# EAGLE design riffle328-REVA (EAGLE 6.5.0)
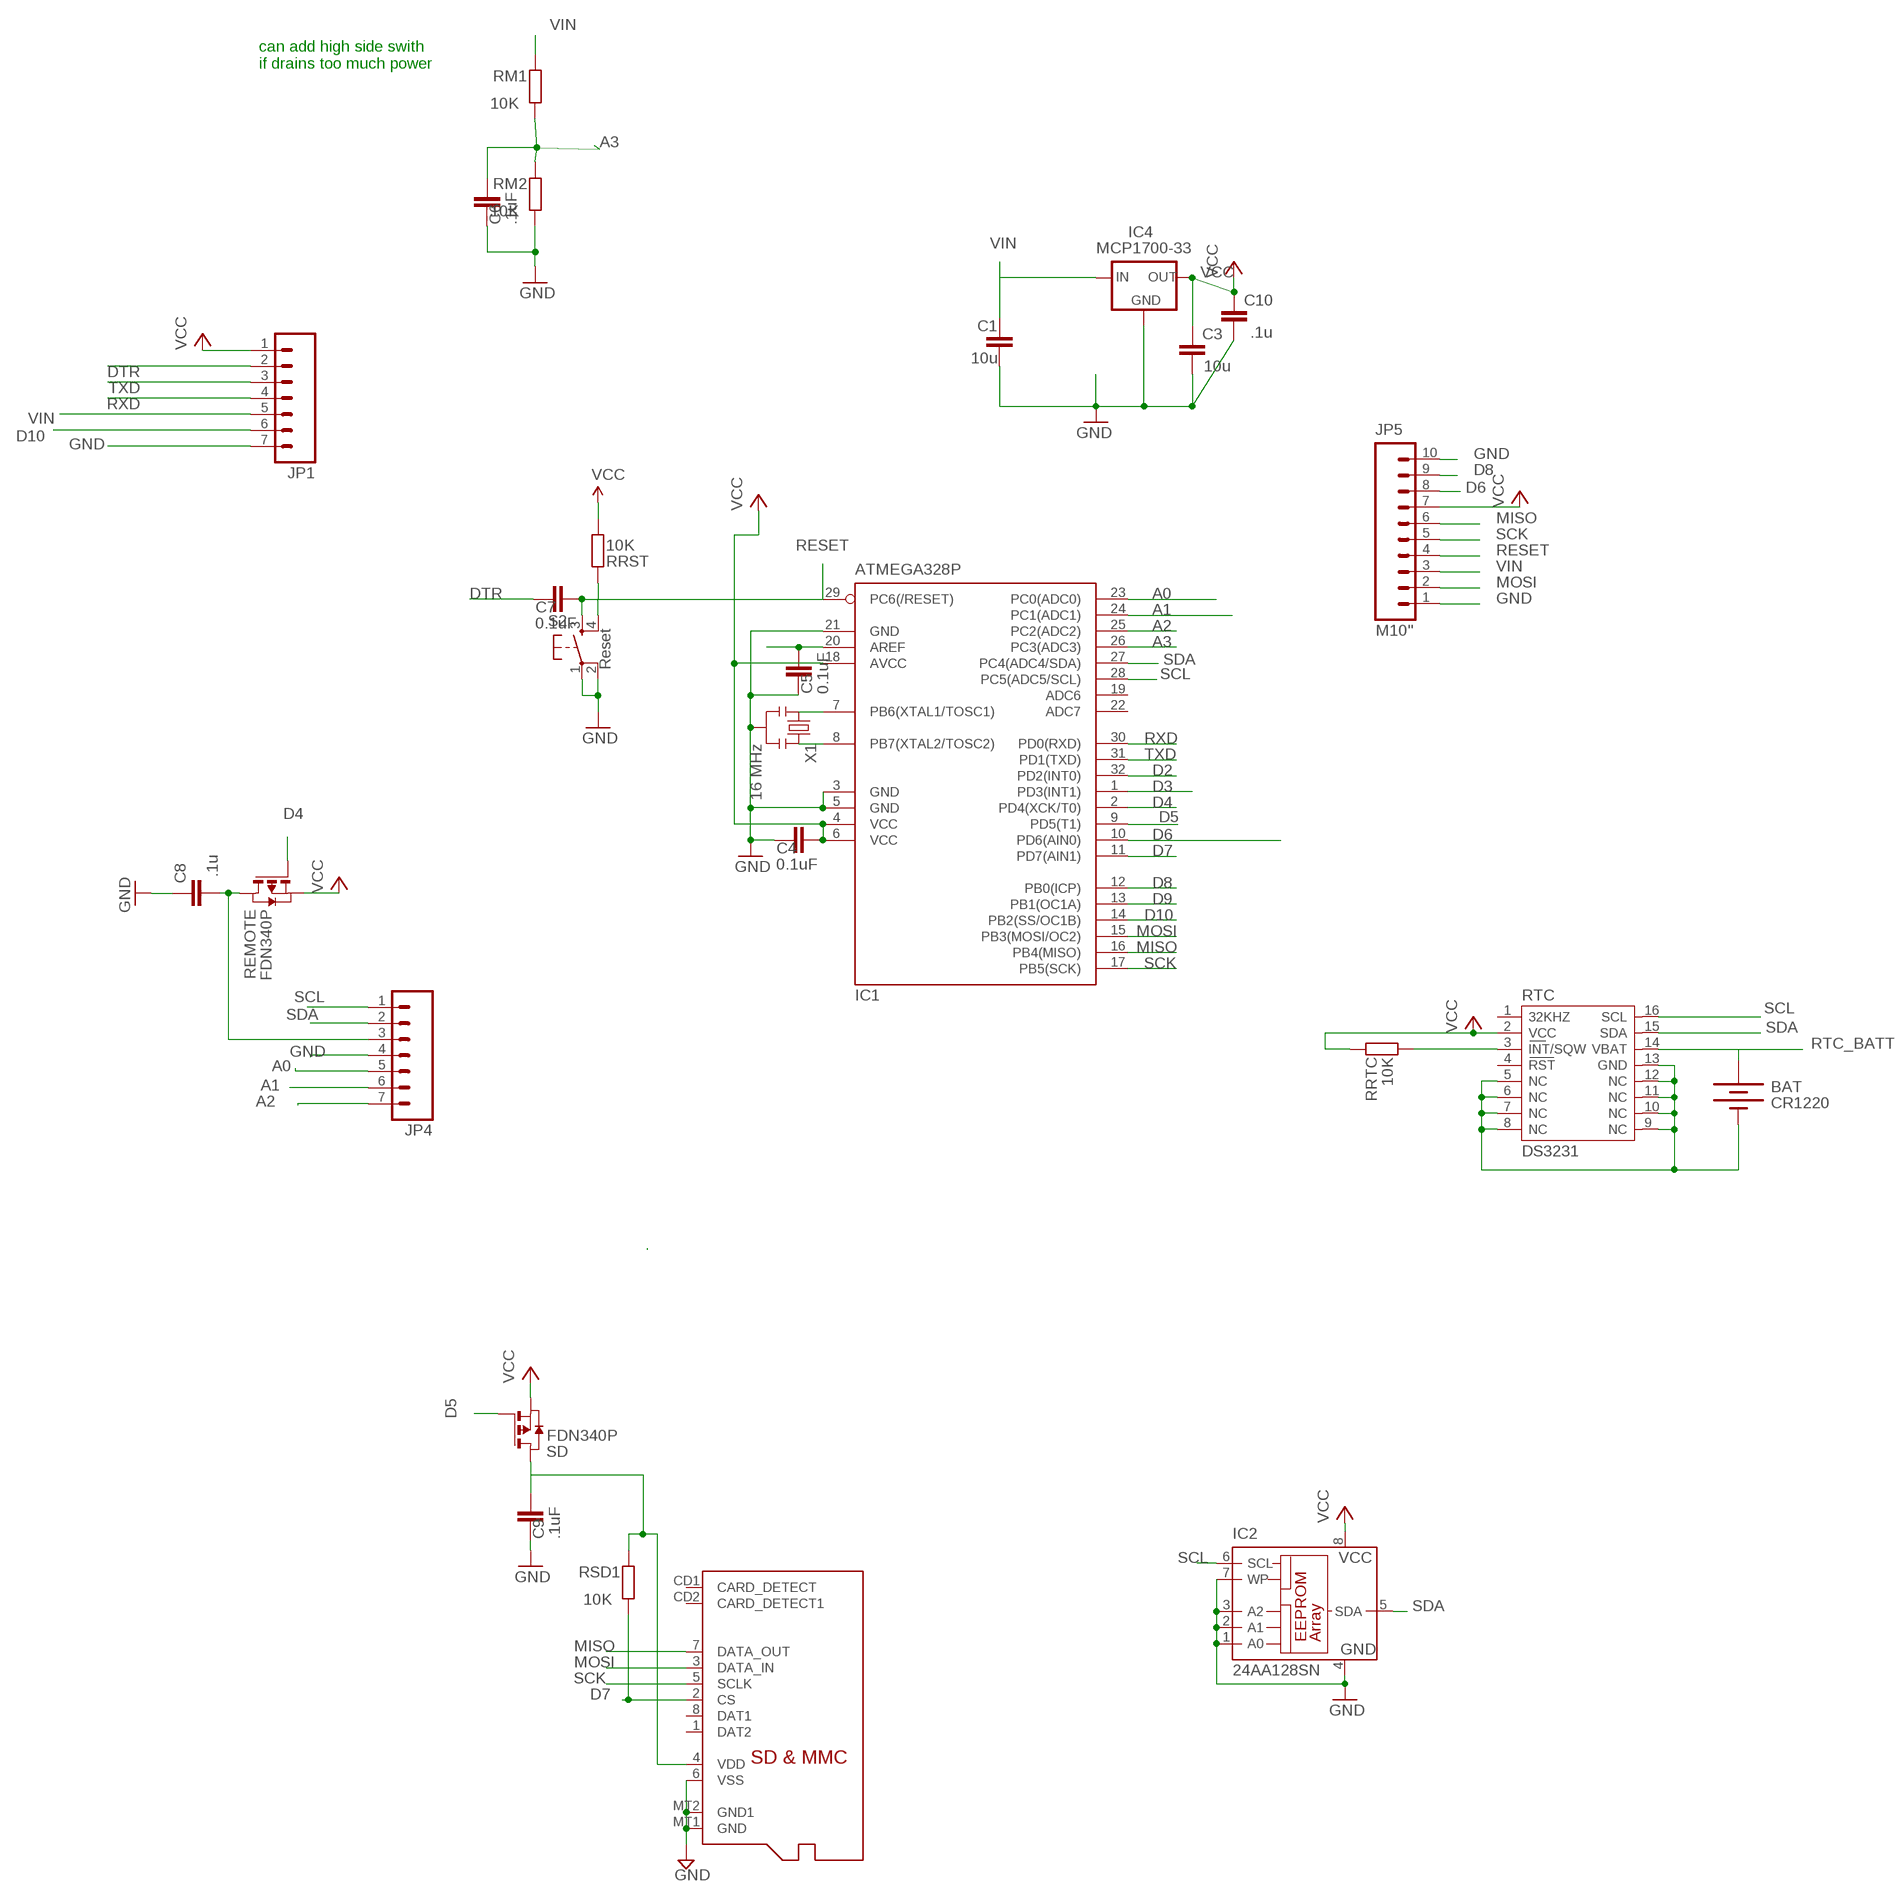
[diagram p0: schematic, sheet 1]

## Parts
BAT  CR1220  BATTERYBATTERY_12MM_SMT  [BATTCON_12MM_SMT]
C1  10u  C-EUC0805  [C0805]
C3  10u  C-EUC0805  [C0805]
C4  0.1uF  C-EUC0805  [C0805@1]
C5  0.1uF  C-EUC0805  [C0805@1]
C6  .1uF  C-EUC0805  [C0805@1]
C7  0.1uF  C-EUC0805  [C0805@1]
C8  .1u  C-EUC0805  [C0805]
C9  .1uF  C-EUC0805  [C0805@1]
C10  .1u  C-EUC0805  [C0805]
IC1  ATMEGA328P  MEGA8-AI  [TQFP32-08]
IC2  24AA128SN  [SO-08]
IC4  MCP1700-33  MCP1700SOT233  [SOT23]
JP1  M07  [1X07]
JP4  M07  [1X07]
JP5  M10"  [1X10]
MICROSD  MICROSD  [MICROSD]
REMOTE  FDN340P  PMOSSOT23  [SOT-23]
RM1  10K  R-EU_R0805  [R0805]
RM2  10K  R-EU_R0805  [R0805]
RRST  10K  R-EU_R0805  [R0805]
RRTC  10K  R-EU_R0805  [R0805]
RSD1  10K  R-EU_R0805  [R0805]
RTC  DS3231  [DS3231]
S2  Reset  TAC_SWITCHSMD  [TACTILE_SWITCH_SMD]
SD  FDN340P  PMOSSOT23  [SOT-23]
X1  16 MHz  RESONATORSMD  [RESONATOR-SMD]

## Nets
A0: IC1.23(PC0(ADC0)) JP4.5
A1: IC1.24(PC1(ADC1)) JP4.6
A2: IC1.25(PC2(ADC2)) JP4.7
A3: C6.2 IC1.26(PC3(ADC3)) RM1.1 RM2.2
AREF: C5.2 IC1.20(AREF)
D2: IC1.32(PD2(INT0))
D3: IC1.1(PD3(INT1))
D4: IC1.2(PD4(XCK/T0)) REMOTE.3(G)
D5: IC1.9(PD5(T1)) SD.3(G)
D6: IC1.10(PD6(AIN0)) JP5.8
D7: IC1.11(PD7(AIN1)) MICROSD.2(CS) RSD1.1
D8: IC1.12(PB0(ICP)) JP5.9
D9: IC1.13(PB1(OC1A))
D10: IC1.14(PB2(SS/OC1B)) JP1.6
DTR: C7.1 JP1.2
GND: BAT.P$1(-) C1.2 C3.2 C4.1 C5.1 C6.1 C8.1 C9.1 C10.2 IC1.3(GND) IC1.5(GND) IC1.21(GND) IC2.1(A0) IC2.2(A1) IC2.3(A2) IC2.4(GND) IC2.7(WP) IC4.1(GND) JP1.7 JP4.4 JP5.1 JP5.10 MICROSD.6(VSS) MICROSD.MT1(GND) MICROSD.MT2(GND1) RM2.1 RTC.5(NC) RTC.6(NC) RTC.7(NC) RTC.8(NC) RTC.9(NC) RTC.10(NC) RTC.11(NC) RTC.12(NC) RTC.13(GND) S2.1 S2.2 X1.2
MISO: IC1.16(PB4(MISO)) JP5.6 MICROSD.7(DATA_OUT)
MOSI: IC1.15(PB3(MOSI/OC2)) JP5.2 MICROSD.3(DATA_IN)
N$2: IC1.8(PB7(XTAL2/TOSC2)) X1.3
N$3: IC1.7(PB6(XTAL1/TOSC1)) X1.1
N$16: RRTC.1 RTC.3(INT/SQW)
RESET: C7.2 IC1.29(PC6(/RESET)) JP5.4 RRST.2 S2.3 S2.4
RTC_BATT: BAT.P$2(+) RTC.14(VBAT)
RXD: IC1.30(PD0(RXD)) JP1.4
SCK: IC1.17(PB5(SCK)) JP5.5 MICROSD.5(SCLK)
SCL: IC1.28(PC5(ADC5/SCL)) IC2.6(SCL) JP4.1 RTC.16(SCL)
SDA: IC1.27(PC4(ADC4/SDA)) IC2.5(SDA) JP4.2 RTC.15(SDA)
TXD: IC1.31(PD1(TXD)) JP1.3
VCC: C3.1 C4.2 C8.2 C10.1 IC1.4(VCC) IC1.6(VCC) IC1.18(AVCC) IC2.8(VCC) IC4.2(OUT) JP1.1 JP4.3 JP5.7 REMOTE.1(D) REMOTE.2(S) RRST.1 RRTC.2 RTC.2(VCC) SD.2(S)
VDD: C9.2 MICROSD.4(VDD) RSD1.2 SD.1(D)
VIN [power]: C1.1 IC4.3(IN) JP1.5 JP5.3 RM1.2
Unconnected: IC1.19(ADC6) IC1.22(ADC7) MICROSD.1(DAT2) MICROSD.8(DAT1) MICROSD.CD1(CARD_DETECT) MICROSD.CD2(CARD_DETECT1) RTC.1(32KHZ) RTC.4(RST)

## Notes on the sheet
- can add high side swith
  if drains too much power

## Library data of the parts
BAT = SparkFunNew:BATTERY: Battery Holders Various common sizes : AA, AAA, 20mm coin cell and 12mm coin cell.
C1 C3 C8 C10 = resistor:C-EU: CAPACITOR, European symbol
C4-C7 C9 = rcl:C-EU: CAPACITOR, European symbol
IC1 = atmel:MEGA8: MICROCONTROLLER 8 Kbytes FLASH, 1 kbytes SRAM, 512 bytes EEPROM, USART, 6-channel 10 bit ADC, 2-channel 8 bit ADC Pin compatible with Atmega48, ATMega88, ATMega168 Source: avr.lbr; MPN: ATMEGA8-16AU; OC_FARNELL: 9171371; OC_NEWARK: 73M8863
IC2 = microchip:24*: Serial EEPROM I2C; MF: MICROCHIP; MPN: 24AA128-I/SN; OC_FARNELL: unknown; OC_NEWARK: 92C6842
IC4 = adafruit:MCP1700: VOLTAGE REGULATOR
JP1 JP4 = SparkFun-Connectors:M07: Header 7 Standard 7-pin 0.1" header. Use with straight break away headers (SKU : PRT-00116), right angle break away headers (PRT-00553), swiss pins (PRT-00743), machine pins (PRT-00117), and female headers (PRT-00115). NOTES ON THE VARIANTS LOCK and LOCK_LONGPADS... This footprint was designed to help hold the alignment of a through-hole component (i.e. 7-pin header) while soldering it into place. You may notice that each hole has been shifted either up or down by 0.005 of an inch from it's more standard position (which is usually a perfectly straight line). This slight alteration caused the pins (the squares in the middle) to touch the edges of the holes. Because they are alternating, it causes a "brace" to hold the header in place. 0.005 has proven to be the perfect amount of "off-center" position when using our standard breakaway headers. Although looks a little odd when you look at the bare footprint, once you have a header in there, the alteration is very hard to notice. Also, if you push a header all the way into place, it is covered up entirely on the bottom side. This idea of altering the position of holes to aid alignment will be further integrated into the Sparkfun Library for other footprints. It can help hold any component with 3 or more connection pins.
JP5 = SparkFun-Connectors:M10: Header 10 Standard 10-pin 0.1" header. Use with straight break away headers (SKU : PRT-00116), right angle break away headers (PRT-00553), swiss pins (PRT-00743), machine pins (PRT-00117), and female headers (PRT-00115).
MICROSD = adafruit:MICROSD: Micro-SD / Transflash card holder with SPI pinout For the 3M # 2908-05WB-MG and/or 4UCON #19656 push-push type
REMOTE SD = zetex:PMOSSOT23: MOS FET
RM1 RM2 RRST RRTC RSD1 = rcl:R-EU_: RESISTOR, European symbol
RTC = _lh-library:DS3231
S2 = SparkFun:TAC_SWITCH: Momentary Switch Button commonly used for reset or general input. Spark Fun Electronics SKU : COM-00097
X1 = SparkFun:RESONATOR: Resonator Small SMD resonator. This is the itty bitty 10/20MHz resonators with built in caps. CSTCE10M0G55 and CSTCE20M0V53. Footprint has been reviewed closely but hasn't been tested yet.

## Net classes
0 default: width 0.203 mm, clearance 0.203 mm
1 power: width 0.381 mm, clearance 0.254 mm

## Board
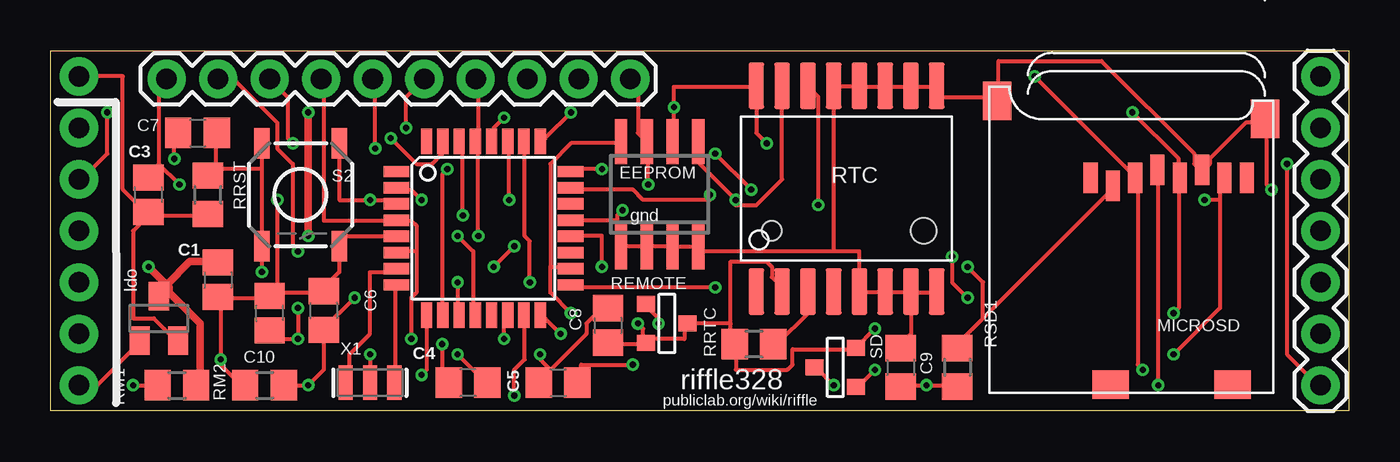
[diagram p1: board, top side]
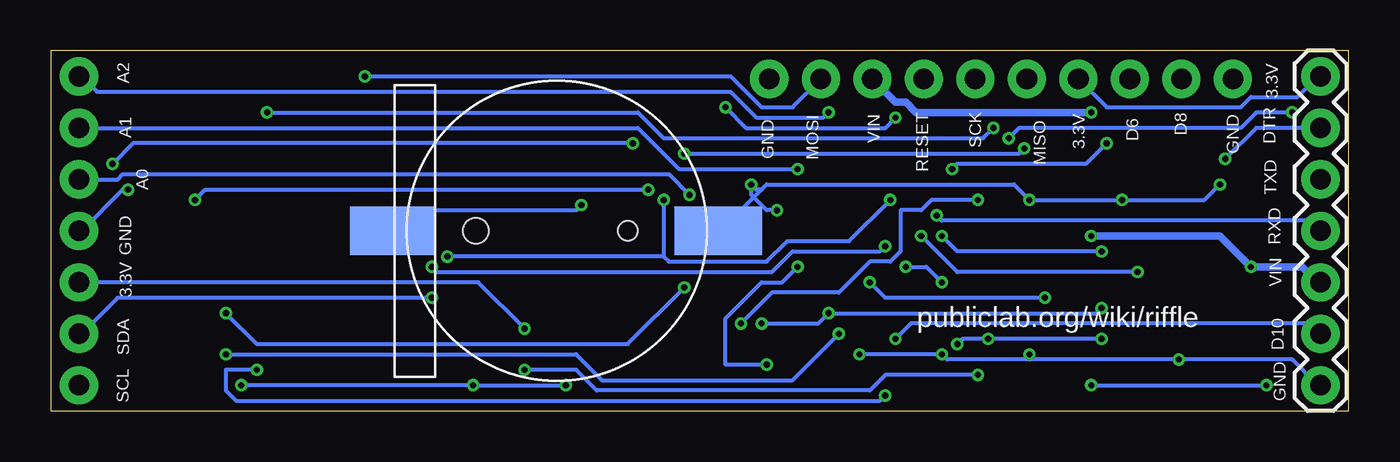
[diagram p2: board, bottom side, seen from below]

Size 64.01 x 17.78 mm. Coordinates in mm from the lower left corner, seen from the top.
Outline: 0,0 0,17.78 64.01,17.78 64.01,0 0,0
Copper layers (1*2*15*16): Top 0.035mm / dielectric 0.2mm / layer 2 0.0175mm / dielectric 1.1mm / layer 15 0.0175mm / dielectric 0.2mm / Bottom 0.035mm
Design rules "SeeedStudio_DRU_no_angle_20130527": minimum track width 6mil, minimum drill 12mil, track to track 6mil, track to pad 6mil, pad to pad 6mil, via to via 6mil, smd to smd 0mil, copper to edge 10mil, drill to drill 10mil, minimum pad ring 6mil, minimum via ring 6mil, stop-mask expansion 2mil, vias tented up to drill 25mil, thermal gap 10mil

### Footprints (pad centres in the part's own frame; a part is rotated, then mirrored left to right if it is on the bottom)
BATTCON_12MM_SMT = smd 2.4 x 4.3: P$1 0,11.96 | smd 2.4 x 4.2: P$2 0,-4.1 | hole 0.95: 0,7.5 | hole 1.25: 0,0
C0805 = smd 1.3 x 1.5: 1 -0.85,0; 2 0.85,0
C0805@1 = smd 1.3 x 1.5: 1 -0.95,0; 2 0.95,0
TQFP32-08 = smd 1.27 x 0.559: 1 -4.293,2.8; 2 -4.293,2; 3 -4.293,1.2; 4 -4.293,0.4; 5 -4.293,-0.4; 6 -4.293,-1.2; 7 -4.293,-2; 8 -4.293,-2.8; 17 4.293,-2.8; 18 4.293,-2; 19 4.293,-1.2; 20 4.293,-0.4; 21 4.293,0.4; 22 4.293,1.2; 23 4.293,2; 24 4.293,2.8 | smd 0.559 x 1.27: 9 -2.8,-4.293; 10 -2,-4.293; 11 -1.2,-4.293; 12 -0.4,-4.293; 13 0.4,-4.293; 14 1.2,-4.293; 15 2,-4.293; 16 2.8,-4.293; 25 2.8,4.293; 26 2,4.293; 27 1.2,4.293; 28 0.4,4.293; 29 -0.4,4.293; 30 -1.2,4.293; 31 -2,4.293; 32 -2.8,4.293
SO-08 = smd 0.6 x 2.2: 1 -1.905,-2.6; 2 -0.635,-2.6; 3 0.635,-2.6; 4 1.905,-2.6; 5 1.905,2.6; 6 0.635,2.6; 7 -0.635,2.6; 8 -1.905,2.6
SOT23 = smd 1 x 1.4: 1 -0.95,-1.1; 2 0.95,-1.1; 3 0,1.1
1X07 = drill 1.016 pad 1.88: 1 0,0; 2 2.54,0; 3 5.08,0; 4 7.62,0; 5 10.16,0; 6 12.7,0; 7 15.24,0
1X10 = drill 1.016 pad 1.88: 1 0,0; 2 2.54,0; 3 5.08,0; 4 7.62,0; 5 10.16,0; 6 12.7,0; 7 15.24,0; 8 17.78,0; 9 20.32,0; 10 22.86,0
MICROSD = smd 0.7 x 1.5: 1 9,-10.64; 2 7.9,-10.24; 3 6.8,-10.64; 4 5.7,-11.04; 5 4.6,-10.64; 6 3.5,-11.04; 7 2.4,-10.64; 8 1.3,-10.64 | smd 1.8 x 1.4: CD1 2,-0.44; CD2 8,-0.44 | smd 1.4 x 1.9: MT1 0.4,-13.54; MT2 13.6,-14.44
SOT-23 = smd 0.787 x 0.889: 1 0.025,-1.016; 2 -0.94,1.016; 3 0.991,1.016
R0805 = smd 1.3 x 1.5: 1 -0.95,0; 2 0.95,0
DS3231 = smd 0.762 x 2.286: 1 -4.445,-5.08; 2 -3.175,-5.08; 3 -1.905,-5.08; 4 -0.635,-5.08; 5 0.635,-5.08; 6 1.905,-5.08; 7 3.175,-5.08; 8 4.445,-5.08; 9 4.445,5.08; 10 3.175,5.08; 11 1.905,5.08; 12 0.635,5.08; 13 -0.635,5.08; 14 -1.905,5.08; 15 -3.175,5.08; 16 -4.445,5.08
TACTILE_SWITCH_SMD = smd 1.524 x 0.762: 1 -2.54,1.905; 2 2.54,1.905; 3 -2.54,-1.905; 4 2.54,-1.905
RESONATOR-SMD = smd 0.7 x 1.7: 1 -1.2,0; 2 0,0; 3 1.2,0

### Placement (x,y rotation side)
BAT  43.05,8.89 270 bottom
C1  8.25,6.48 270 top
C3  4.83,10.67 90 top
C4  20.57,1.4 180 top
C5  25.02,1.4 0 top
C6  13.46,4.95 270 top
C7  7.24,13.72 0 top
C8  27.48,4.22 270 top
C9  41.91,2.16 270 top
C10  10.79,4.83 90 top
IC1  21.34,9.02 0 top
IC2  30.02,10.69 0 top
IC4  5.33,4.57 0 top
JP1  1.4,16.51 270 bottom
JP4  62.61,1.27 90 top
JP5  28.58,16.38 180 top
MICROSD  60.27,0.86 180 top
REMOTE  30.38,4.29 90 top
RM1  6.22,1.27 0 top
RM2  10.54,1.27 0 top
RRST  7.75,10.67 90 top
RRTC  34.67,3.3 180 top
RSD1  44.7,2.16 270 top
RTC  39.24,10.97 0 top
S2  12.32,10.67 270 top
SD  38.68,2.18 270 top
X1  15.75,1.4 0 top

### Tracks (layer width: path | path; a pad name or v marks a point on that pad's centre or on a via)
A0  (via drill 0.3)
  Top 0.203: v32.51,10.67 32.51,10.41 29.21,10.41 28.7,10.92 25.65,10.92 IC1.23
  Bottom 0.203: v32.51,10.67 33.53,11.68 60.45,11.68 60.71,11.43 JP4.5
A1  (via drill 0.3)
  Top 0.203: v27.18,11.94 25.65,11.94 IC1.24
  Bottom 0.203: v27.18,11.94 33.02,11.94 35.05,13.97 JP4.6
A2  (via drill 0.3)
  Top 0.203: v25.65,14.73 24.38,13.46 IC1.25
  Bottom 0.203: v25.65,14.73 25.91,14.48 29.21,14.48 30.48,15.75 61.72,15.75 62.48,16.51 JP4.7
A3  (via drill 0.3)
  Top 0.203: v4.06,1.27 RM1.1 | RM2.2 v12.7,1.27 13.46,2.03 C6.2 13.46,4.06 v14.99,5.59 | v23.62,6.35 23.62,8.38 23.37,8.64 23.37,13.21 IC1.26
  Bottom 0.203: v12.7,1.27 v4.06,1.27 | v23.62,6.35 22.86,5.59 v14.99,5.59
AREF  (via drill 0.3)
  Top 0.203: v27.18,7.11 27.18,8.64 25.65,8.64 IC1.20 | v28.7,2.29 26.16,2.29 26.16,1.52 C5.2
  Bottom 0.203: v27.18,7.11 27.94,6.35 28.96,6.35 30.73,4.57 30.73,2.29 v28.7,2.29
D4  (via drill 0.3)
  Top 0.203: v29.97,4.32 29.97,4.57 29.46,5.08 REMOTE.3 | v18.29,10.41 17.78,10.92 17.27,10.92 IC1.2
  Bottom 0.203: v29.97,4.32 28.45,5.84 25.15,5.84 23.62,7.37 22.61,7.37 22.1,7.87 22.1,9.91 21.08,9.91 20.57,10.41 v18.29,10.41
D5  (via drill 0.3)
  Top 0.203: v40.64,2.03 39.88,1.27 SD.3 | v18.29,1.78 18.54,2.03 18.54,4.57 IC1.9
  Bottom 0.203: v40.64,2.03 38.1,2.03 37.08,1.02 23.62,1.02 22.86,1.78 v18.29,1.78
D6  (via drill 0.3)
  Top 0.203: v19.56,11.94 19.3,11.68 19.3,4.83 IC1.10 | v11.94,13.21 11.68,13.46 11.68,15.49 JP5.8
  Bottom 0.203: v19.56,11.94 19.3,12.19 12.95,12.19 v11.94,13.21
D7  (via drill 0.3)
  Top 0.203: v20.07,6.35 20.07,4.83 IC1.11 | v22.86,8.13 v21.84,7.11 | v45.21,7.11 45.97,6.35 45.97,4.57 | 45.97,4.57 44.7,3.3 RSD1.1 | 45.97,4.57 52.32,10.92 MICROSD.2
  Bottom 0.203: v20.07,6.35 20.83,7.11 v21.84,7.11 | v22.86,8.13 23.11,7.87 27.43,7.87 28.45,6.86 44.96,6.86 v45.21,7.11
D8  (via drill 0.3)
  Top 0.203: v20.07,8.64 20.83,7.87 20.83,4.83 IC1.12 | v12.19,7.87 11.94,8.13 11.94,12.19 11.18,12.95 11.18,14.22 9.14,16.26 8.38,16.26 JP5.9
  Bottom 0.203: v20.07,8.64 19.3,7.87 v12.19,7.87
D10  (via drill 0.3)
  Top 0.203: v22.35,3.56 22.35,4.57 IC1.14
  Bottom 0.203: v22.35,3.56 21.59,4.32 2.03,4.32 1.52,3.81 JP1.6
DTR  (via drill 0.3)
  Top 0.203: v6.1,12.45 6.1,13.72 C7.1
  Bottom 0.203: v6.1,12.45 4.57,13.97 JP1.2
GND  (via drill 0.3)
  Top 0.203: IC1.5 17.02,8.64 14.22,8.64 S2.2 14.22,6.86 13.46,6.1 C6.1 13.46,5.84 11.18,5.84 | 8.38,5.59 v8.38,2.54 8.38,2.29 9.4,1.27 RM2.1 | 8.38,5.59 10.67,5.59 C10.2 | 8.38,5.59 C1.2 | 11.18,5.84 10.92,5.84 C10.2 | 24.64,2.03 26.42,3.81 26.42,4.32 26.92,4.83 27.43,4.83 C8.1 | 24.64,2.03 24.13,1.52 C5.1 24.64,2.03 | JP1.7 2.29,1.27 4.32,3.3 IC4.1 | v20.07,2.79 21.34,1.52 C4.1 | v15.75,2.79 X1.2 | 24.64,2.03 24.13,2.54 v24.13,2.79 | 5.33,12.19 4.83,11.68 C3.2 | 5.33,12.19 5.33,16 JP5.10 | JP5.1 28.96,16 28.96,13.72 29.21,13.46 IC2.7 29.46,13.21 v29.46,11.18 | S2.1 14.22,10.41 v15.75,10.41 17.02,10.41 IC1.3 | v6.35,11.18 5.33,12.19 | v11.18,10.41 11.18,5.84 | 11.18,5.84 C10.2 | 27.94,9.4 25.65,9.4 IC1.21 | 27.94,9.4 27.94,8.13 IC2.1 28.19,8.13 29.21,8.13 IC2.2 29.46,8.13 30.48,8.13 IC2.3 30.73,8.13 31.75,8.13 IC2.4 | 32,8.13 IC2.4 | 41.15,5.84 39.88,5.84 RTC.5 39.88,7.87 38.61,7.87 | 42.42,5.84 42.42,3.81 41.91,3.3 C9.1 | 42.42,5.84 43.69,5.84 RTC.8 | 42.42,5.84 41.15,5.84 | 41.15,5.84 RTC.6 | 42.42,5.84 RTC.7 | 38.61,7.87 32,7.87 IC2.4 | 43.69,16 43.69,15.49 46.48,15.49 MICROSD.MT2 46.74,15.49 46.74,17.27 51.82,17.27 56.39,12.7 56.39,12.19 56.64,11.94 MICROSD.6 56.9,11.94 57.15,12.19 57.15,12.45 58.93,14.22 59.69,14.22 MICROSD.MT1 59.94,14.22 59.94,11.18 v60.2,10.92 | 39.88,16 38.61,16 | 39.88,16 41.15,16 | 39.88,16 RTC.12 | 41.15,16 42.42,16 | 41.15,16 RTC.11 | 42.42,16 43.69,16 | 43.69,16 RTC.9 | 42.42,16 RTC.10 | 38.61,16 38.61,7.87 | 38.61,16 RTC.13 | v28.19,9.91 27.94,9.65 27.94,9.4
  Bottom 0.203: 15.75,2.54 v8.38,2.54 2.79,2.54 1.52,1.27 JP1.7 | 15.75,2.54 19.81,2.54 v20.07,2.79 v24.13,2.79 | 15.75,2.54 v15.75,2.79 | 28.96,10.92 30.99,8.89 BAT.P$1 | 28.96,10.92 28.7,11.18 16.51,11.18 v15.75,10.41 v11.18,10.41 7.11,10.41 v6.35,11.18 | 28.96,10.92 29.21,10.92 v29.46,11.18 29.46,10.67 28.7,9.91 v28.19,9.91 | v60.2,10.92 60.45,10.92 62.48,8.89 JP4.4
MISO  (via drill 0.3)
  Top 0.203: v25.15,3.81 24.38,4.57 IC1.16 | v55.37,2.79 57.66,5.08 57.66,10.41 | 57.66,10.41 57.66,11.43 MICROSD.7 | v16,12.95 16,16.26 JP5.6 | v34.54,10.92 v32.77,12.7 | 57.66,10.41 v56.9,10.41
  Bottom 0.203: v25.15,3.81 27.43,1.52 36.83,1.52 38.1,2.79 v55.37,2.79 | v16,12.95 16.26,12.7 v32.77,12.7 | v34.54,10.92 56.39,10.92 v56.9,10.41
MOSI  (via drill 0.3)
  Top 0.203: v22.86,0.76 22.86,2.03 23.37,2.54 23.37,4.57 IC1.15 | v53.85,2.03 53.59,2.29 53.59,11.43 MICROSD.3 53.34,11.68 v48.51,16.51
  Bottom 0.203: v22.86,0.76 23.11,0.51 54.86,0.51 55.37,1.02 55.37,2.03 v53.85,2.03 | JP5.2 27.43,14.99 28.96,14.99 30.48,16.51 v48.51,16.51
N$2
  Top 0.203: IC1.8 17.02,6.1 17.02,1.52 X1.3
N$3
  Top 0.203: IC1.7 17.02,6.86 15.75,6.86 15.75,3.81 14.73,2.79 14.73,1.52 X1.1
N$16
  Top 0.203: RTC.3 37.34,4.83 35.81,3.3 RRTC.1
RESET  (via drill 0.3)
  Top 0.203: JP5.4 21.08,16.26 21.08,13.46 IC1.29 21.08,13.21 v21.08,8.64 | 8.13,11.94 7.87,11.68 RRST.2 8.13,11.94 | 8.13,11.94 8.13,13.72 C7.2 | S2.3 10.41,11.94 | 10.41,11.94 S2.4 v10.41,6.86 | 10.41,11.94 8.13,11.94
  Bottom 0.203: v21.08,8.64 19.3,6.86 v10.41,6.86
RTC_BATT  (via drill 0.3)
  Top 0.203: v37.85,10.16 37.85,15.49 37.34,16 RTC.14
  Bottom 0.203: v37.85,10.16 38.1,9.91 45.97,9.91 46.99,8.89 BAT.P$2
RXD  (via drill 0.3)
  Top 0.203: v20.32,9.65 20.32,13.21 IC1.30
  Bottom 0.203: v20.32,9.65 20.07,9.4 2.03,9.4 1.52,8.89 JP1.4
SCK  (via drill 0.3)
  Top 0.203: v32.77,6.1 25.65,6.1 IC1.17 | v55.37,4.83 55.63,5.08 55.63,11.43 MICROSD.5 55.63,11.68 55.63,12.45 v53.34,14.73 | JP5.5 17.53,15.49 v17.53,13.97
  Bottom 0.203: v32.77,6.1 35.56,3.3 53.85,3.3 v55.37,4.83 | v17.53,13.97 18.03,13.46 33.78,13.46 35.05,14.73 v53.34,14.73
SCL  (via drill 0.3)
  Top 0.203: v22.35,14.48 21.84,13.97 21.84,13.46 IC1.28 | IC2.6 30.73,13.46 v30.73,14.99 30.73,16 34.8,16 | v60.96,12.19 60.96,2.79 62.48,1.27 JP4.1 | v35.31,13.21 34.8,13.72 34.8,16 | 34.8,16 RTC.16
  Bottom 0.203: v22.35,14.48 22.86,13.97 29.72,13.97 v30.73,14.99 | v60.96,12.19 59.94,13.21 v35.31,13.21
SDA  (via drill 0.3)
  Top 0.203: v22.61,10.41 22.61,13.21 IC1.27 | IC2.5 32,13.21 32,12.19 v33.78,10.41 33.78,10.16 34.8,10.16 36.07,11.43 RTC.15 | v45.21,5.59 44.45,6.35 v44.45,7.62
  Bottom 0.203: v22.61,10.41 24.64,8.38 27.69,8.38 28.7,7.37 33.53,7.37 33.78,7.62 | v33.78,10.41 33.78,7.62 | v45.21,5.59 60.71,5.59 62.48,3.81 JP4.2 | 33.78,7.62 v44.45,7.62
TXD  (via drill 0.3)
  Top 0.203: v16.76,13.46 18.03,12.19 18.8,12.19 19.3,12.7 19.3,13.21 IC1.31 | v2.79,14.73 2.79,12.7 1.52,11.43 JP1.3
  Bottom 0.203: v16.76,13.46 16.26,13.97 5.33,13.97 4.57,14.73 v2.79,14.73
VCC  (via drill 0.3)
  Top 0.203: 4.83,9.65 4.06,8.89 4.06,4.57 5.08,4.57 6.1,3.56 IC4.2 | 4.83,9.65 7.62,9.65 RRST.1 | JP1.1 3.56,16.51 3.56,10.92 4.83,9.65 | 4.83,9.65 C3.1 | v19.3,3.3 19.3,1.78 19.56,1.52 C4.2 | C10.1 10.92,3.81 10.92,3.56 v12.19,3.56 v12.19,5.08 | 18.03,7.87 17.27,7.87 IC1.6 | 18.03,7.87 18.03,9.14 17.78,9.4 17.27,9.4 IC1.4 17.02,9.4 13.46,9.4 13.46,16.26 JP5.7 | v17.78,3.56 17.78,5.59 18.03,5.84 18.03,7.87 | 24.64,7.11 25.4,7.11 IC1.18 | 24.64,7.11 24.64,12.19 25.65,13.21 27.94,13.21 IC2.8 28.19,13.46 | REMOTE.2 29.21,3.3 27.69,3.3 C8.2 | 33.53,4.32 REMOTE.1 31.24,4.32 31.24,3.56 29.46,3.56 REMOTE.2 | 33.53,4.32 33.53,3.3 RRTC.2 33.78,3.3 33.78,2.03 36.32,2.03 36.58,2.29 36.58,3.05 39.62,3.05 SD.2 v40.64,4.06 | 33.53,4.32 33.53,7.37 35.31,7.37 35.56,7.11 35.56,6.6 36.07,6.1 RTC.2 | 24.64,7.11 24.64,5.84 v25.65,4.83 | v28.96,4.32 29.21,4.06 29.21,3.56 REMOTE.2
  Bottom 0.203: v19.3,3.3 19.05,3.56 v17.78,3.56 v12.19,3.56 | JP5.7 11.94,14.99 5.33,14.99 4.83,15.49 2.54,15.49 1.52,16.51 JP1.1 | JP4.3 42.93,6.35 v40.64,4.06 | v28.96,4.32 26.16,4.32 v25.65,4.83 12.45,4.83 v12.19,5.08
VDD  (via drill 0.3)
  Top 0.203: v38.61,1.27 37.85,2.03 SD.1 | C9.2 41.91,1.27 v43.18,1.27 44.7,1.27 RSD1.2 | v54.61,1.27 54.61,11.68 MICROSD.4
  Bottom 0.203: v38.61,1.27 v43.18,1.27 v54.61,1.27
VIN  (via drill 0.3)
  Top 0.381: 5.71,6.22 6.86,7.37 8.13,7.37 C1.1 | 5.71,6.22 5.33,5.84 IC4.3 5.59,6.35 v4.83,7.11 | RM1.2 7.37,1.27 7.37,4.32 5.84,5.84 5.84,6.1 5.71,6.22 | v12.7,8.64 v12.7,14.73
  Bottom 0.381: JP1.5 1.52,6.35 2.29,7.11 v4.83,7.11 6.35,8.64 v12.7,8.64 | JP5.3 22.35,15.24 21.84,15.24 21.34,14.73 v12.7,14.73

### Text on the board
tPlace: EEPROM | gnd | ldo | riffle328 | publiclab.org/wiki/riffle
bPlace: A2 | 3.3V | GND | D8 | 3.3V | SCK | RESET | VIN | MOSI | A1 | D6 | MISO | GND | DTR | A0 | TXD | GND | RXD | 3.3V | VIN | publiclab.org/wiki/riffle | SDA | D10 | SCL | GND